# EAGLE design 1 (EAGLE 6.4)
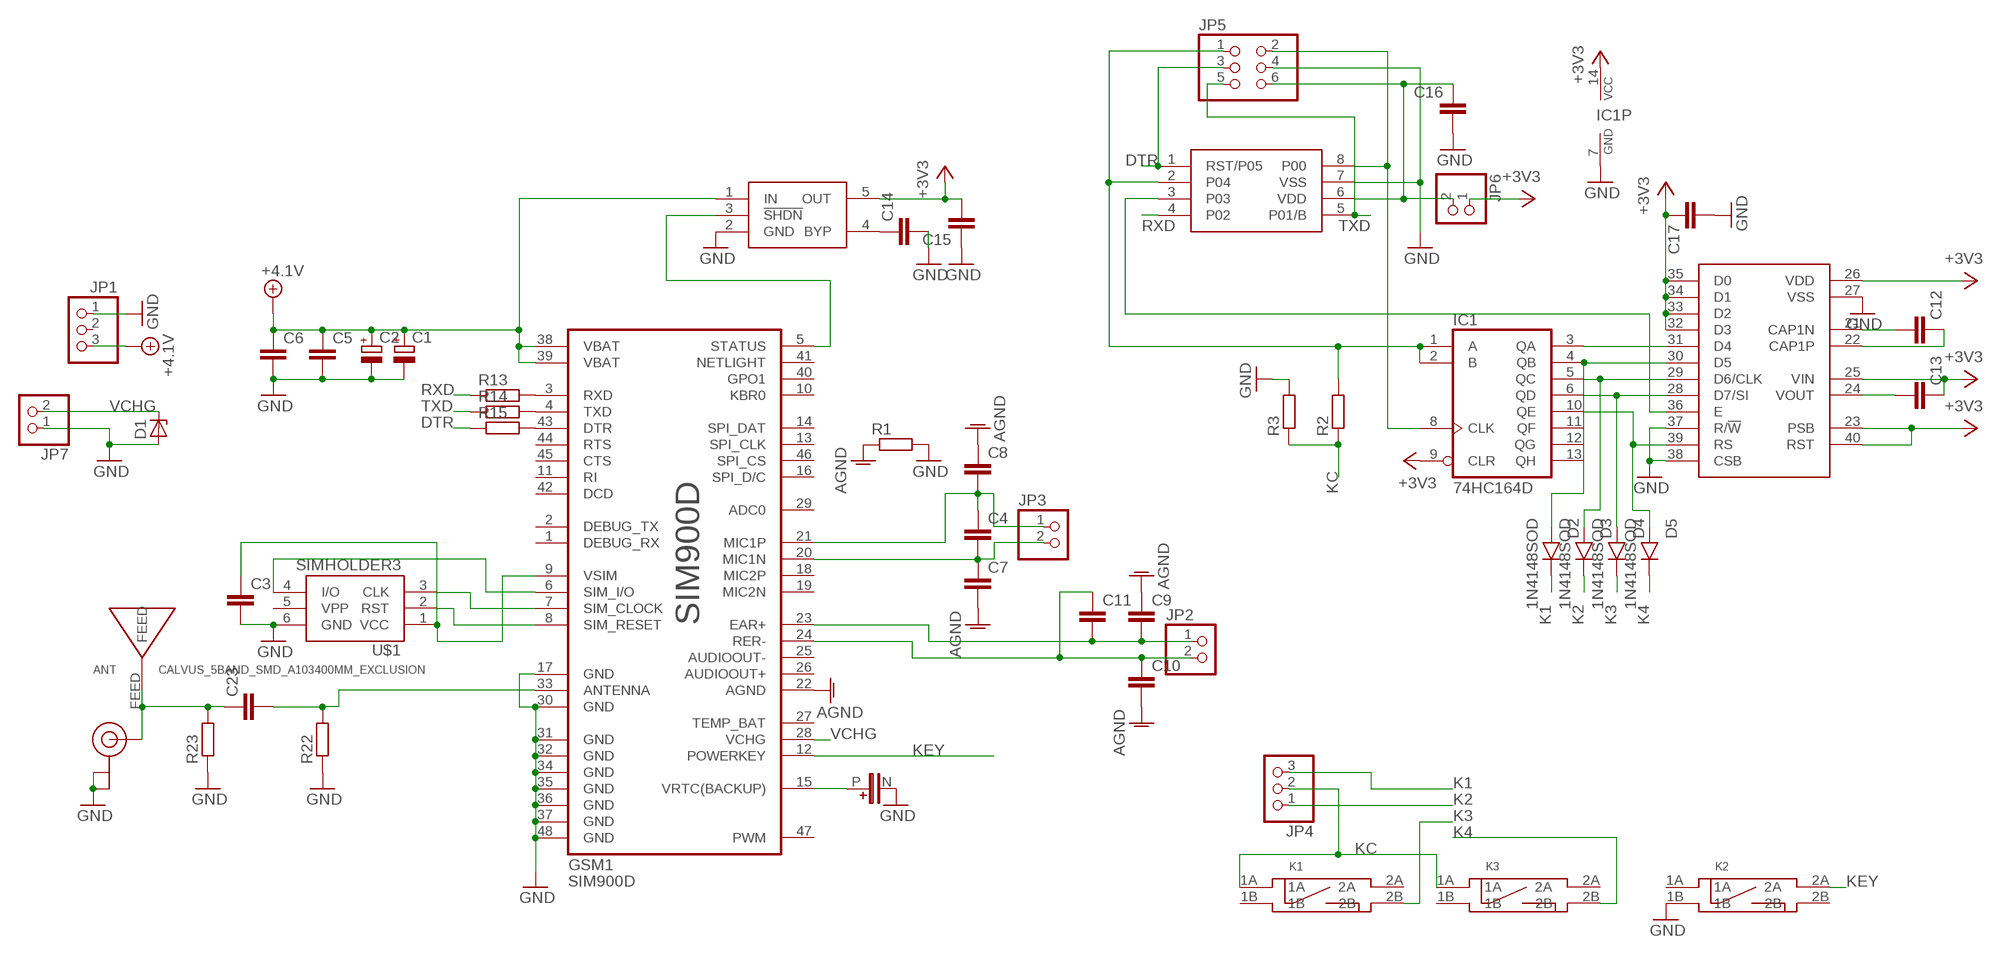
[diagram p0: schematic, sheet 1]

## Parts
ANT  CALVUS_5BAND_SMD_A103400MM_EXCLUSION  [CALVUS_5BAND_SMD_A10340_0MM_EXCLUSION]
C1  CPOL-EUSMCB  [SMC_B]
C2  CPOL-EUSMCB  [SMC_B]
C3  C_0806  [R0805]
C4  C_0806  [R0805]
C5  C_1206  [R1206]
C6  C_1206  [R1206]
C7  C_0806  [R0805]
C8  C_0806  [R0805]
C9  C_0806  [R0805]
C10  C_0806  [R0805]
C11  C_0806  [R0805]
C12  C_0806  [R0805]
C13  C_0806  [R0805]
C14  C_0806  [R0805]
C15  C_0806  [R0805]
C16  C_0806  [R0805]
C17  C_0806  [R0805]
C23  C_0603  [0603]
D1  ZENER-DIODESMB  [SMB]
D2  1N4148SOD  [SOD-80]
D3  1N4148SOD  [SOD-80]
D4  1N4148SOD  [SOD-80]
D5  1N4148SOD  [SOD-80]
GSM1  SIM900D  [SIM900D]
IC1  74HC164D  [SO14]
JP1  PINHD-1X03_2.54-90°  [1X03/90]
JP2  PINHD-1X02_2.00  [1X02M]
JP3  PINHD-1X02_2.00  [1X02M]
JP4  PINHD-1X03_2.54-90°  [1X03/90]
JP5  PINHD-2X3  [2X03]
JP6  PINHD-1X02_2.54-S  [1X02-S]
JP7  PINHD-1X02_2.54-90°  [1X02/90]
K1  SWITCH_BD_B  [SW_SMD2]
K2  SWITCH_BD_B  [SW_SMD2]
K3  SWITCH_BD_B  [SW_SMD2]
LCD2  EAGOG_M  [EADOGM]
R1  R_0805  [R0805]
R2  R_0805  [R0805]
R3  R_0805  [R0805]
R13  R_0805  [R0805]
R14  R_0805  [R0805]
R15  R_0805  [R0805]
R22  R_0603  [0603]
R23  R_0603  [0603]
U$1  SIMHOLDER3  [SIMHOLDER3]
U$2  LPC810DIP  [DIL8]
U$3  TC1015  [SOT23-5]
U$4  SUPERCAP10  [SUPERCAP_10]
U$10  U.FL  [U.FL]

## Nets
+3V3: C13.1 C15.2 C17.1 IC1.9(CLR) IC1.14(VCC) JP6.1 LCD2.23(PSB) LCD2.25(VIN) LCD2.26(VDD) LCD2.32(D3) LCD2.33(D2) LCD2.34(D1) LCD2.35(D0) LCD2.40(RST) U$3.5(OUT)
+4.1V: C1.+ C2.+ C5.1 C6.1 GSM1.38(VBAT) GSM1.39(VBAT) JP1.3 U$3.1(IN)
ABC: IC1.1(A) IC1.2(B) JP5.1 R2.2 U$2.2(P04)
AGND: C7.2 C8.1 C9.1 C10.2 GSM1.22(AGND) R1.1
DTR: JP5.3 R15.1 U$2.1(RST/P05)
GND: C1.- C2.- C3.2 C5.2 C6.2 C14.2 C15.1 C16.2 C17.2 D1.A GSM1.17(GND) GSM1.30(GND) GSM1.31(GND) GSM1.32(GND) GSM1.34(GND) GSM1.35(GND) GSM1.36(GND) GSM1.37(GND) GSM1.48(GND) IC1.7(GND) JP1.1 JP5.4 JP7.1 K2.1B LCD2.27(VSS) LCD2.37(R/!W) LCD2.38(CSB) R1.2 R3.2 R22.1 R23.1 U$1.6(GND) U$2.7(VSS) U$3.2(GND) U$4.N U$10.P$1(GND) U$10.P$2(GND)
K1: D2.K JP4.3
K2: D3.K JP4.1
K3: D4.K K1.2B
K4: D5.K K3.2B
KC: JP4.2 K1.1A K3.1A R2.1 R3.1
KEY: GSM1.12(POWERKEY) K2.2A
N$1: GSM1.8(SIM_RESET) U$1.2(RST)
N$2: GSM1.7(SIM_CLOCK) U$1.3(CLK)
N$3: GSM1.6(SIM_I/O) U$1.4(I/O)
N$4: C3.1 GSM1.9(VSIM) U$1.1(VCC)
N$5: GSM1.5(STATUS) U$3.3(!SHDN)
N$6: C14.1 U$3.4(BYP)
N$10: C16.1 JP5.6 JP6.2 U$2.6(VDD)
N$11: IC1.8(CLK) JP5.2 U$2.8(P00)
N$12: C4.2 C7.1 GSM1.20(MIC1N) JP3.2
N$13: C4.1 C8.2 GSM1.21(MIC1P) JP3.1
N$14: C9.2 C11.2 GSM1.23(EAR+) JP2.1
N$15: C10.1 C11.1 GSM1.24(RER-) JP2.2
N$16: D5.A IC1.10(QE) LCD2.39(RS)
N$17: LCD2.36(E) U$2.3(P03)
N$18: C13.2 LCD2.24(VOUT)
N$19: C12.2 LCD2.21(CAP1N)
N$20 [antenna]: C23.2 GSM1.33(ANTENNA) R22.2
N$21: C12.1 LCD2.22(CAP1P)
N$22: IC1.3(QA) LCD2.31(D4)
N$25: D4.A IC1.6(QD) LCD2.28(D7/SI)
N$26: GSM1.3(RXD) R13.2
N$27: GSM1.4(TXD) R14.2
N$28: GSM1.43(DTR) R15.2
N$31: D2.A IC1.4(QB) LCD2.30(D5)
N$32: D3.A IC1.5(QC) LCD2.29(D6/CLK)
N$33 [antenna]: ANT.FEED C23.1 R23.2 U$10.P$3(SIGNAL)
RXD: R13.1 U$2.4(P02)
TXD: JP5.5 R14.1 U$2.5(P01/B)
VCHG: D1.C GSM1.28(VCHG) JP7.2
VRTC(BACKUP): GSM1.15(VRTC(BACKUP)) U$4.P
Unconnected: GSM1.1(DEBUG_RX) GSM1.2(DEBUG_TX) GSM1.10(KBR0) GSM1.11(RI) GSM1.13(SPI_CLK) GSM1.14(SPI_DAT) GSM1.16(SPI_D/C) GSM1.18(MIC2P) GSM1.19(MIC2N) GSM1.25(AUDIOOUT-) GSM1.26(AUDIOOUT+) GSM1.27(TEMP_BAT) GSM1.29(ADC0) GSM1.40(GPO1) GSM1.42(DCD) GSM1.44(RTS) GSM1.45(CTS) GSM1.46(SPI_CS) GSM1.47(PWM) IC1.11(QF) IC1.12(QG) IC1.13(QH) JP1.2 K1.1B K1.2A K2.1A K2.2B K3.1B K3.2A U$1.5(VPP)

## Power pins joined to a net without a drawn wire
NETLIGHT: GSM1.41(NETLIGHT)

## Library data of the parts
ANT = SmartPrj:CALVUS_5BAND_SMD_A10340
C1 C2 = _rcl:CPOL-EU: POLARIZED CAPACITOR, European symbol
C3-C17 C23 = _moja:C
D1 = diode:ZENER-DIODE: Z-Diode
D2-D5 = _mcom5:1N4148
GSM1 = SIM900D:SIM900D: maciek@chwarzno.pl Maciej Kalinowski SIM900D MARITEX: SIM900D http://wm.sim.com/upfile/201264161119f.pdf
IC1 = 74xx-eu:74*164: 8-bit parallel out SHIFT REGISTER
JP1 JP4 = pinhead-2:PINHD-1X03: PIN HEADER
JP2 JP3 JP6 JP7 = pinhead-2:PINHD-1X02: PIN HEADER
JP5 = pinhead:PINHD-2X3: PIN HEADER
K1-K3 = _moja:SWITCH_BD
LCD2 = _mcom5:EAGOG_M
R1-R3 R13-R15 R22 R23 = _moja:R
U$1 = SparkFun:SIMHOLDER3
U$2 = _mcom5:LPC810
U$3 = _moja:TC1015
U$4 = _moja:SUPERCAP
U$10 = SparkFun:U.FL

## Net classes
4 antenna: clearance 0.61 mm

## Board
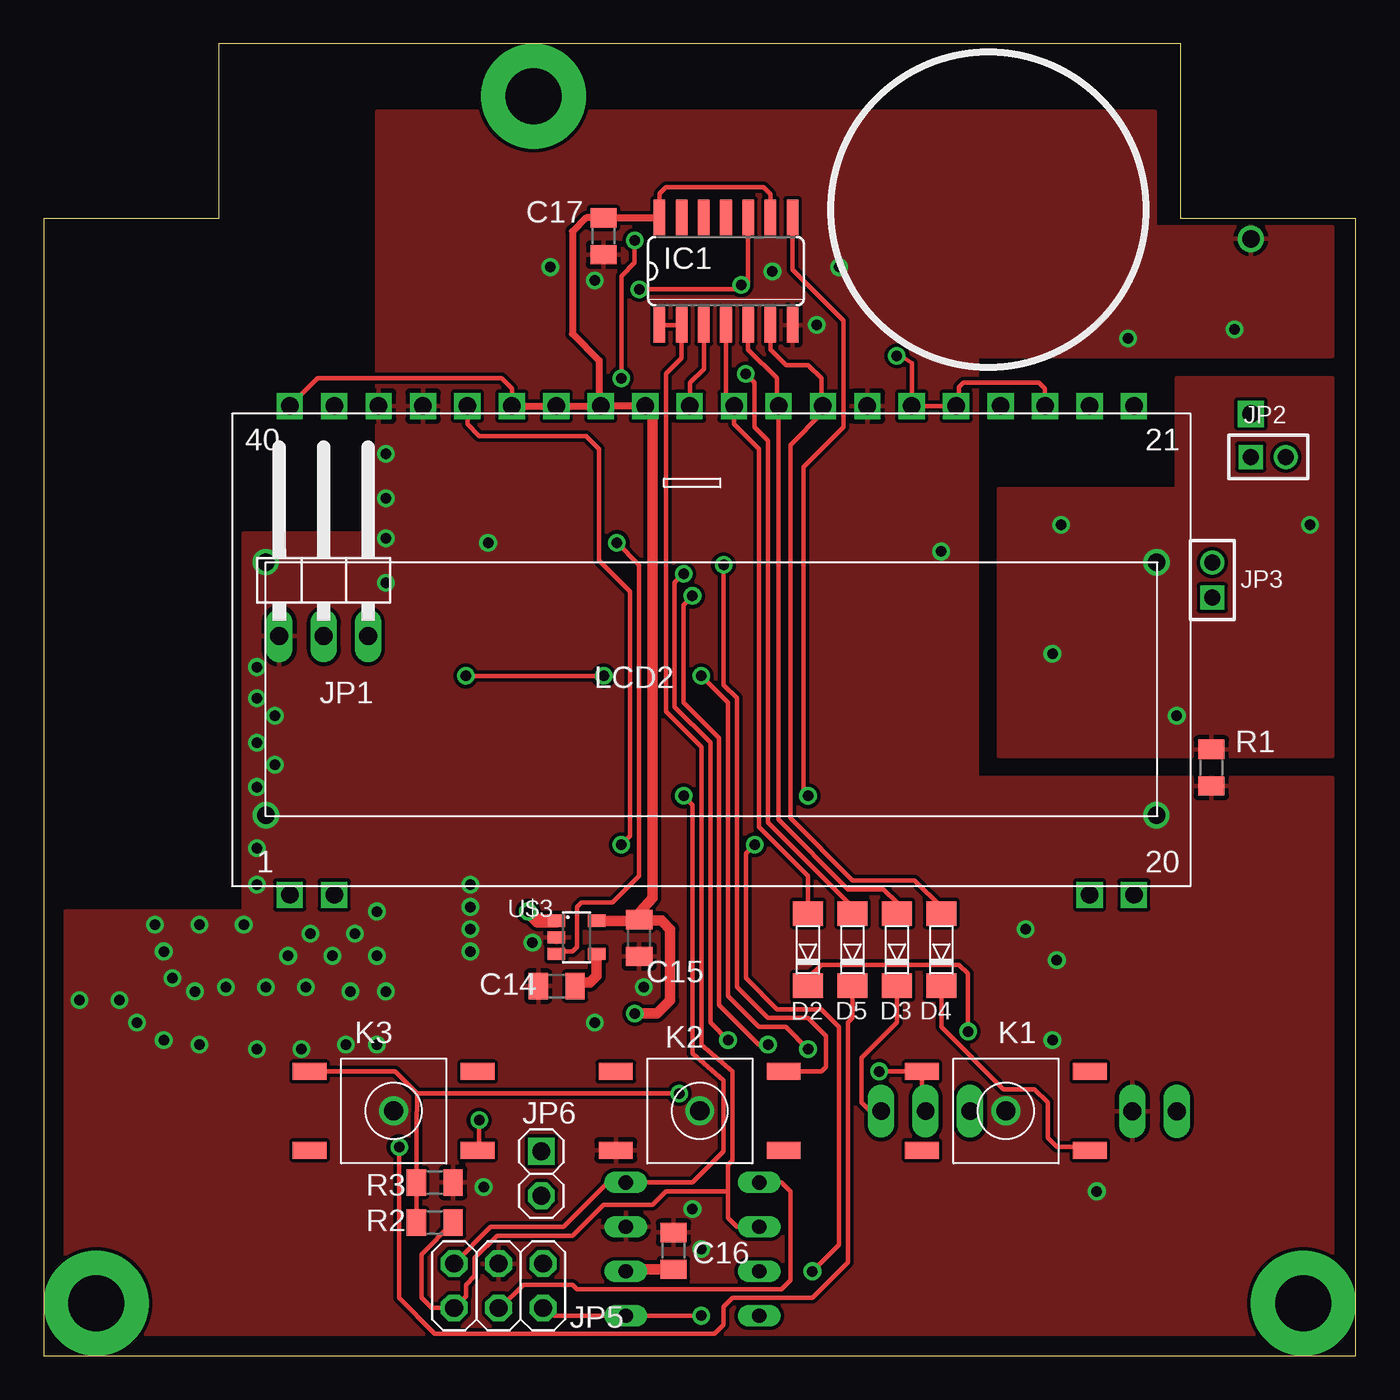
[diagram p1: board, top side]
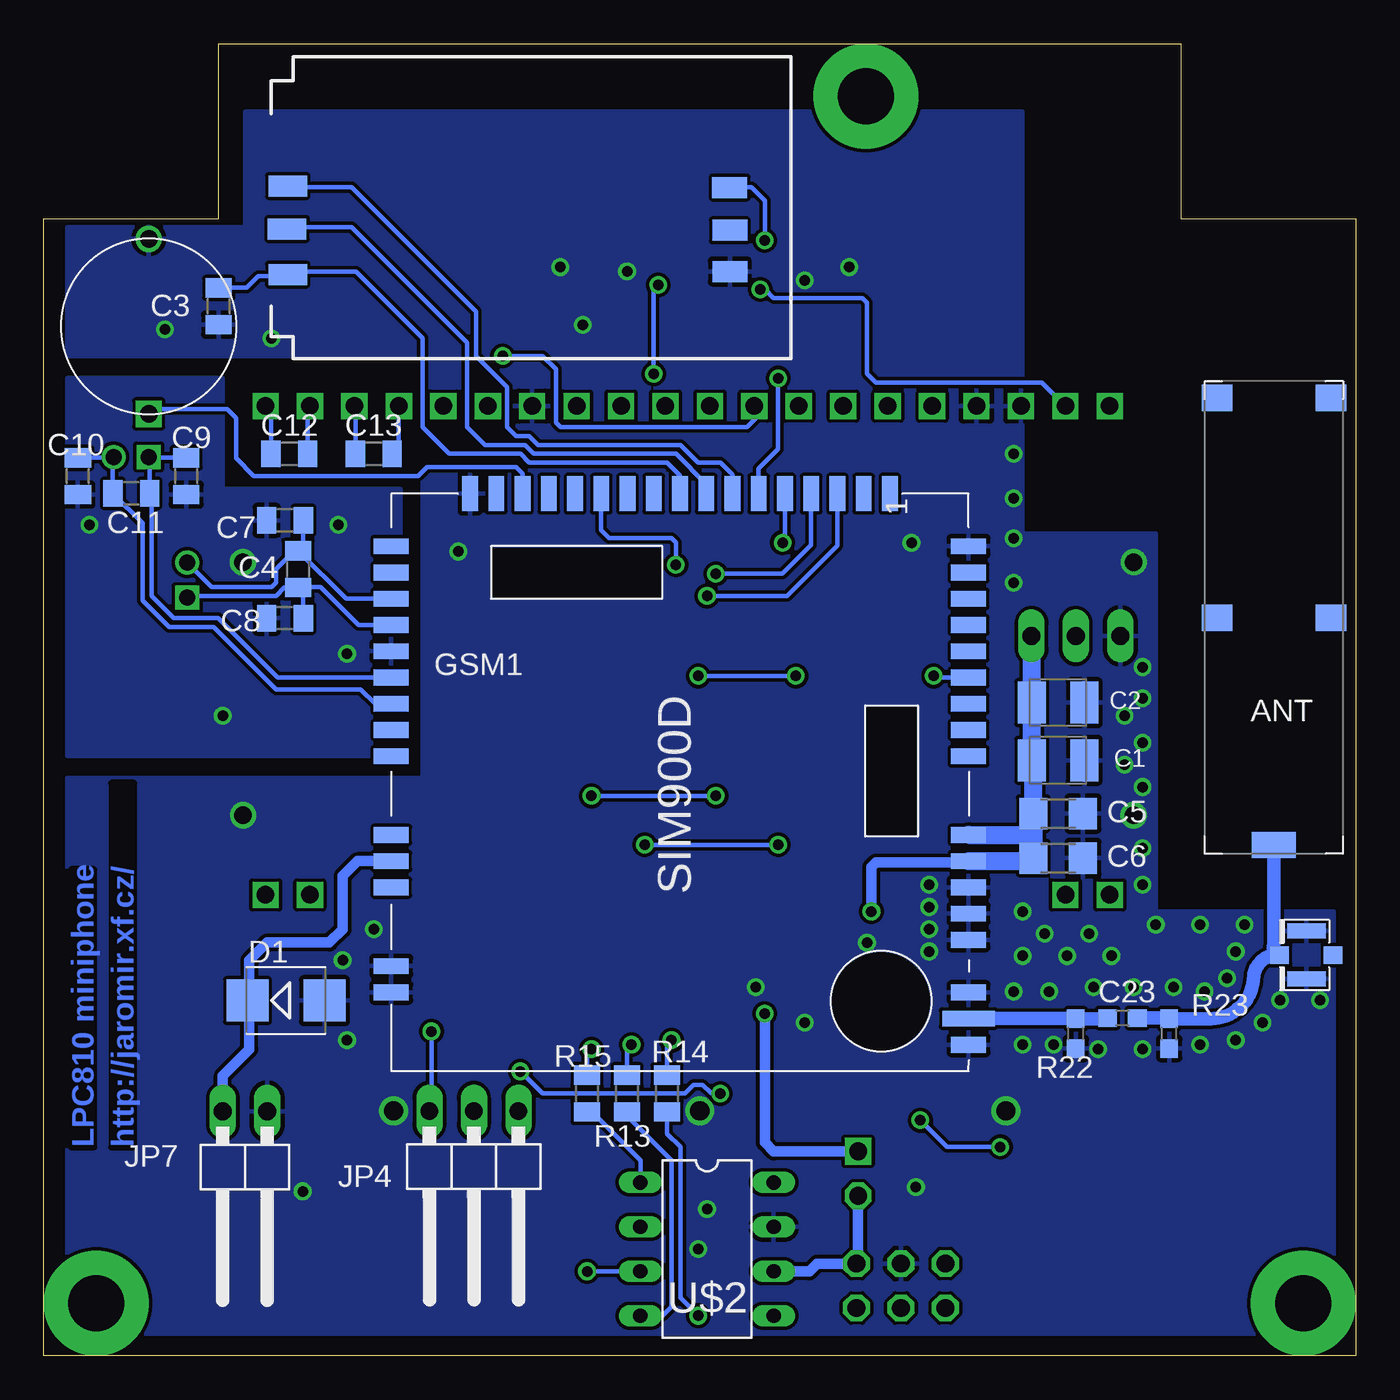
[diagram p2: board, bottom side, seen from below]

Size 75 x 75 mm. Coordinates in mm from the lower left corner, seen from the top.
Outline: 0,0 75,0 75,65 65,65 65,75 10,75 10,65 0,65 0,0
Copper layers (1*16): Top 0.035mm / dielectric 1.5mm / Bottom 0.035mm
Design rules "check8": minimum track width 8mil, minimum drill 23mil, track to track 8mil, track to pad 8mil, pad to pad 8mil, via to via 8mil, smd to smd 8mil, copper to edge 10mil, drill to drill 8mil, minimum pad ring 8mil, minimum via ring 8mil, stop-mask expansion 4mil, vias tented up to drill 0mil, thermal gap 10mil

### Footprints (pad centres in the part's own frame; a part is rotated, then mirrored left to right if it is on the bottom)
CALVUS_5BAND_SMD_A10340_0MM_EXCLUSION = smd 2.5 x 1.5: FEED 3.95,0.5 | smd 1.75 x 1.5: FIXINGPOINT$1 0.7,26.05; FIXINGPOINT$2 7.22,26.05; FIXINGPOINT$3 0.7,13.49; FIXINGPOINT$4 7.22,13.49
SMC_B = smd 1.6 x 2.4: + -1.5,0; - 1.5,0
R0805 = smd 1.1 x 1.5: 1 -1.05,0; 2 1.05,0
R1206 = smd 1.6 x 1.803: 1 -1.422,0; 2 1.422,0
0603 = smd 1.067 x 1: 1 -0.85,0; 2 0.85,0
SMB = smd 2.4 x 2.4: A 2.2,0; C -2.2,0
SOD-80 = smd 1.397 x 1.702: A 1.905,0; K -2.223,0
SIM900D = smd 2 x 0.9: 1 0,28.5; 2 0,27; 3 0,25.5; 4 0,24; 5 0,22.5; 6 0,21; 7 0,19.5; 8 0,18; 9 0,16.5; 10 0,15; 11 0,13.5; 12 0,12; 13 0,10.5; 14 0,9; 15 0,7.5; 16 0,6; 17 0,4.5 | smd 0.9 x 2: 18 3,0; 19 4.5,0; 20 6,0; 21 7.5,0; 22 9,0; 23 10.5,0; 24 12,0; 25 13.5,0; 26 15,0; 27 19.5,0; 28 21,0; 29 22.5,0; 30 27,0; 31 28.5,0; 32 31.5,33; 34 28.5,33; 35 25.5,33; 36 24,33; 37 22.5,33; 38 21,33; 39 19.5,33; 40 15,33; 41 13.5,33; 42 12,33; 43 10.5,33; 44 9,33; 45 7.5,33; 46 6,33; 47 4.5,33; 48 3,33 | smd 0.9 x 3: 33 30,33
SO14 = smd 0.66 x 2.032: 1 -3.81,-3.073; 2 -2.54,-3.073; 3 -1.27,-3.073; 4 0,-3.073; 5 1.27,-3.073; 6 2.54,-3.073; 7 3.81,-3.073; 8 3.81,3.073; 9 2.54,3.073; 10 1.27,3.073; 11 0,3.073; 12 -1.27,3.073; 13 -2.54,3.073; 14 -3.81,3.073
1X03/90 = drill 1.016 long: 1 -2.54,-3.81; 2 0,-3.81; 3 2.54,-3.81
1X02M = drill 0.914 square: 1 -1,0 | drill 0.914: 2 1,0
2X03 = drill 1.016 octagon: 1 -2.54,-1.27; 2 -2.54,1.27; 3 0,-1.27; 4 0,1.27; 5 2.54,-1.27; 6 2.54,1.27
1X02-S = drill 1.016 square: 1 -1.27,0 | drill 1.016 octagon: 2 1.27,0
1X02/90 = drill 1.016 long: 1 -2.54,-3.81; 2 0,-3.81
SW_SMD2 = smd 1.93 x 0.965: 1A -4.8,2.25; 1B -4.8,-2.25; 2A 4.8,2.25; 2B 4.8,-2.25
EADOGM = drill 1 square: 1 -23.44,-13.65; 2 -20.9,-13.65; 19 22.28,-13.65; 20 24.82,-13.65; 21 24.82,14.29; 22 22.28,14.29; 23 19.74,14.29; 24 17.2,14.29; 25 14.66,14.29; 26 12.12,14.29; 27 9.58,14.29; 28 7.04,14.29; 29 4.5,14.29; 30 1.96,14.29; 31 -0.58,14.29; 32 -3.12,14.29; 33 -5.66,14.29; 34 -8.2,14.29; 35 -10.74,14.29; 36 -13.28,14.29; 37 -15.82,14.29; 38 -18.36,14.29; 39 -20.9,14.29; 40 -23.44,14.29
SIMHOLDER3 = smd 2.2 x 1.2: 1 0.95,4.81; 2 0.91,7.41; 3 0.95,9.86 | smd 2 x 1.2: 4 26.2,9.78; 5 26.22,7.34; 6 26.22,4.98
DIL8 = drill 0.813 long: 1 -3.81,-3.81; 2 -1.27,-3.81; 3 1.27,-3.81; 4 3.81,-3.81; 5 3.81,3.81; 6 1.27,3.81; 7 -1.27,3.81; 8 -3.81,3.81
SOT23-5 = smd 0.7 x 1: 1 -0.99,-1.17; 2 -0.04,-1.17; 3 0.91,-1.17; 4 0.91,1.13; 5 -0.99,1.13
SUPERCAP_10 = drill 1: N 5,0 | drill 1 square: P -5,0
U.FL = smd 2.2 x 0.85: P$1 0,1.375; P$2 0,-1.375 | smd 1.05 x 1: P$3 1.525,0; P$4 -1.525,0

### Placement (x,y rotation side)
ANT  8.64,28.7 0 bottom
C1  17.02,34.04 0 bottom
C2  17.02,37.34 0 bottom
C3  65,60 270 bottom
C4  60.45,44.96 90 bottom
C5  17.02,30.99 0 bottom
C6  17.02,28.45 0 bottom
C7  61.21,47.75 180 bottom
C8  61.21,42.16 0 bottom
C9  66.86,50.28 90 bottom
C10  73.05,50.28 270 bottom
C11  70,49.3 0 bottom
C12  60.96,51.56 180 bottom
C13  56.13,51.56 0 bottom
C14  29.33,21.13 180 top
C15  34.04,23.88 90 top
C16  36,6 90 top
C17  32,64 270 top
C23  13.34,19.3 180 bottom
D1  61.15,20.31 0 bottom
D2  43.69,23.37 90 top
D3  48.77,23.37 90 top
D4  51.31,23.37 90 top
D5  46.23,23.37 90 top
GSM1  55.13,49.27 270 bottom
IC1  39,62 0 top
JP1  16,44.96 0 top
JP2  70,51.38 0 top
JP3  66.8,44.34 90 top
JP4  50.41,10.18 180 bottom
JP5  26,4 0 top
JP6  28.45,10.41 270 top
JP7  64.77,10.16 180 bottom
K1  55,14 0 top
K2  37.5,14 0 top
K3  20,14 0 top
LCD2  37.5,40 0 top
R1  66.75,33.62 270 top
R2  22.35,7.62 0 top
R3  22.35,9.91 0 top
R13  41.66,14.99 90 bottom
R14  39.37,14.99 90 bottom
R15  43.94,14.99 90 bottom
R22  16,18.41 90 bottom
R23  10.67,18.41 90 bottom
U$1  62,57 0 bottom
U$2  37.08,6.1 270 bottom
U$3  30.48,23.88 270 top
U$4  69,58.85 90 bottom
U$10  2.83,22.91 180 bottom

### Tracks (layer width: path | path; a pad name or v marks a point on that pad's centre or on a via)
+3V3  (via drill 0.6)
  Top 0.254: LCD2.35 26.76,55.28 26.16,55.88 15.65,55.88 LCD2.40 | 35.17,65.05 IC1.14 35.19,66.43 35.56,66.8 41.15,66.8 41.54,66.41 IC1.9 | v48.77,57.15 49.02,57.15 49.62,56.73 LCD2.26 LCD2.25 52.32,54.45 52.32,55.37 52.58,55.63 56.9,55.63 57.24,55.28 LCD2.23
  Top 0.406: LCD2.33 31.75,54.71 31.75,56.9 30.23,58.42 30.23,64.26 31.01,65.05 C17.1 35.17,65.05 | LCD2.32 LCD2.33 | LCD2.33 LCD2.34 LCD2.35
  Top 0.61: C15.2 34.07,25.36 34.8,26.16 34.8,53.95 LCD2.32 | 34.04,24.89 C15.2 | v33.78,19.56 35.05,19.56 35.81,20.32 35.81,24.38 35.31,24.89 34.2,24.89 C15.2 | U$3.5 33.98,24.87 C15.2
  Bottom 0.254: v48.77,57.15 46.48,57.15 45.72,56.39 45.72,53.34 45.47,53.09 34.8,53.09 34.29,53.59 34.29,54.2 LCD2.32 | C13.1 57.18,54.23 LCD2.23
  Bottom 0.61: JP6.1 33.27,11.68 33.78,12.19 v33.78,19.56
+4.1V  (via drill 0.6)
  Top 0.762: U$3.1 28.22,24.87 v27.69,25.4
  Bottom 0.61: v27.69,25.4 27.69,27.94 27.43,28.19 22.21,28.19 GSM1.38
  Bottom 1.016: GSM1.39 18.64,29.77 C5.1 | GSM1.38 19.28,28.27 18.87,28.37 | 18.87,28.37 C6.1 | C5.1 18.44,28.3 18.87,28.37 | C5.1 18.44,33.2 C1.+ C2.+ 18.52,41.12 JP1.3
ABC
  Top 0.254: 39.12,9.4 39.12,10.92 39.37,11.18 39.37,16.26 37.59,17.78 37.59,34.8 35.56,36.83 35.56,56.13 36.46,57.03 IC1.2 IC1.1 | 39.12,9.4 39.12,7.87 39.62,7.37 U$2.2 | R2.2 21.59,5.81 21.59,3.3 22.16,2.73 JP5.1 24.13,3.4 24.13,4.06 24.64,4.57 24.64,5.59 25.91,6.86 30.23,6.86 32,8.64 34.8,8.64 35.56,9.4 39.12,9.4
AGND  (via drill 0.6, 1)
  other vias: 57.66,40.13 58.17,47.5 63.61,45.35 72.39,47.5 64.77,36.58
  pour Top: 73.66,34.29 54.61,34.29 54.61,49.53 64.77,49.53 64.77,55.88 73.66,55.88
  pour Bottom: 73.66,34.29 54.61,34.29 54.61,49.53 64.77,49.53 64.77,55.88 73.66,55.88
DTR
  Top 0.254: JP5.3 26.1,2.73 27.43,4.06 30.23,4.06 30.48,3.81 42.16,3.81 42.67,4.32 42.67,9.4 42.16,9.91 U$2.1
  Bottom 0.254: R15.1 43.65,13.94 40.89,11.18 U$2.1
GND  (via drill 0.6, 1, 1.1)
  other vias: 13.97,22.86 27.94,23.62 31.5,61.47 34.29,21.08 44.2,58.93 41.66,61.98 45.47,62.23 28.96,62.23 57.91,22.61 56.13,24.38 57.66,18.03 37.59,6.1 37.08,8.38 31.5,19.05 19.05,25.4 24.38,24.38 24.38,23.11 19.56,20.83 17.53,20.83 14.99,21.08 12.7,21.08 10.41,21.08 8.64,20.83 7.37,21.59 6.86,23.11 6.35,24.64 4.32,20.32 5.33,19.05 6.86,18.03 8.89,17.78 12.19,17.53 14.73,17.53 17.27,17.78 19.05,17.78 8.89,24.64 11.43,24.64 12.19,26.92 12.19,29.02 12.19,32.51 12.19,35.05 12.19,37.59 12.19,39.37 19.56,44.2 19.56,46.74 19.56,49.02 19.56,51.56 61.98,58.17 68.07,58.67 25.4,46.48 51.31,45.97 25.15,9.65 60.2,9.4 2.03,20.32 24.38,25.65 17.78,24.13 12.7,30.9 13.21,33.78 13.21,36.58 37.5,14 20,14 55,14 63.6,30.9 12.69,45.37 19.05,22.86 16.51,22.86 15.24,24.13 24.38,26.92
  pour Bottom: 1.27,1.27 73.66,1.27 73.66,33.02 53.34,33.02 53.34,57.15 73.66,57.15 73.66,64.52 63.5,64.52 63.5,71.12 19.05,71.12 19.05,46.99 11.43,46.99 11.43,25.4 1.27,25.4
  pour Top: 1.27,1.27 73.66,1.27 73.66,33.02 53.34,33.02 53.34,57.15 73.66,57.15 73.66,64.52 63.5,64.52 63.5,71.12 19.05,71.12 19.05,46.99 11.43,46.99 11.43,25.4 1.27,25.4
K1  (via drill 0.6)
  Top 0.254: D2.K 43.69,21.59 44.45,22.35 52.32,22.35 52.83,21.84 v52.83,18.54
  Bottom 0.254: v52.83,18.54 52.83,14.22 52.95,14.11 JP4.3
K2
  Top 0.254: D3.K 48.77,19.05 46.74,17.02 46.74,14.48 47.24,13.97 47.84,13.97 JP4.1
K3
  Top 0.254: D4.K 51.31,18.8 54.86,15.24 56.64,15.24 57.4,14.48 57.4,12.45 57.91,11.94 59.61,11.94 K1.2B
K4  (via drill 0.6)
  Top 0.254: D5.K 46.23,19.3 45.97,19.05 45.97,5.33 43.94,3.3 39.37,3.3 38.86,2.79 38.86,1.78 38.35,1.27 22.35,1.27 20.32,3.3 v20.32,11.94 | v24.89,13.46 24.89,11.84 K3.2B
  Bottom 0.254: v20.32,11.94 23.37,11.94 v24.89,13.46
KC  (via drill 0.6)
  Top 0.254: v47.75,16.26 K1.1A | K1.1A | R2.1 R3.1 21.3,12.92 21.34,14.99 | K1.1A 50.2,14.15 JP4.2 | K3.1A 20.07,16.25 21.34,14.99 | 21.34,14.99 v36.32,14.99
  Bottom 0.254: v36.32,14.99 36.83,14.99 37.34,15.49 37.85,15.49 38.35,14.99 46.48,14.99 v47.75,16.26
KEY  (via drill 0.6)
  Top 0.254: v38.86,45.21 38.86,38.35 39.62,37.59 39.62,21.08 41.4,19.3 43.69,19.3 44.7,18.29 44.7,16.51 44.45,16.26 K2.2A
  Bottom 0.254: GSM1.12 43.13,47.2 42.67,46.74 39.12,46.74 38.86,46.48 v38.86,45.21
N$1
  Bottom 0.254: GSM1.8 37.13,49.83 38.86,51.56 46.99,51.56 47.5,52.07 49.78,52.07 50.8,53.09 50.8,57.91 57.4,64.52 60.98,64.52 U$1.2
N$2
  Bottom 0.254: GSM1.7 35.63,50.37 36.32,51.05 37.59,51.05 38.61,52.07 46.74,52.07 47.24,52.58 48.01,52.58 48.51,53.09 48.51,55.37 50.29,57.15 50.29,59.69 57.4,66.8 60.99,66.8 U$1.3
N$3  (via drill 0.6)
  Top 0.254: v33.02,55.88 33.02,61.72 33.78,62.48 v33.78,63.75
  Bottom 0.254: GSM1.6 34.13,50.7 33.02,51.82 v33.02,55.88 | U$1.4 35.78,66.8 34.54,66.8 33.78,66.04 v33.78,63.75
N$4
  Bottom 0.254: GSM1.9 38.63,50.32 39.37,51.05 47.24,51.05 47.75,51.56 51.82,51.56 53.34,53.09 53.34,58.17 57.15,61.98 60.88,61.98 U$1.1 61.14,61.72 62.74,61.72 63.41,61.05 C3.1
N$5  (via drill 0.6)
  Top 0.254: v32.77,46.48 34.04,45.21 34.04,27.43 32.51,25.91 30.73,25.91 30.48,25.65 30.48,23.37 30.23,23.11 29.48,23.11 U$3.3 29.46,23.03
  Bottom 0.254: GSM1.5 32.63,46.61 v32.77,46.48
N$6
  Top 0.61: U$3.4 31.61,21.7 31.24,21.34 30.58,21.34 C14.1
N$7  (via drill 3.2 pad 6)
  other vias: 28,72
N$8  (via drill 3.2 pad 6)
  other vias: 3,3
N$9  (via drill 3.2 pad 6)
  other vias: 72,3
N$10
  Top 0.61: C16.1 33.4,4.95 U$2.6
  Bottom 0.61: JP6.2 28.45,5.36 JP5.6 30.8,5.27 31.24,4.83 U$2.6
N$11  (via drill 0.6)
  Top 0.254: IC1.8 42.81,62.09 45.72,59.18 45.72,53.09 43.43,50.8 43.43,32.26 v43.69,32 | v36.58,32 37.08,31.5 37.08,17.27 38.86,15.75 38.86,11.68 37.08,9.91 U$2.8 32.26,9.91 29.72,7.37 25.56,7.37 JP5.2
  Bottom 0.254: v43.69,32 v36.58,32
N$12
  Bottom 0.254: GSM1.20 57.72,43.27 C4.2 | C7.1 60.16,46.3 C4.2 | C4.2 60.45,45.85 60.83,45.85 61.72,44.96 61.72,44.2 61.98,43.94 65.4,43.94 JP3.2
N$13
  Bottom 0.254: GSM1.21 57.01,41.77 59.18,43.94 60.42,43.94 C4.1 | C8.2 60.16,43.62 C4.1 | C4.1 61.25,43.91 61.72,43.43 66.71,43.43 JP3.1
N$14
  Bottom 0.254: GSM1.23 61.63,38.77 65.02,42.16 67.56,42.16 68.83,43.43 68.83,49.18 C11.2 68.95,51.33 JP2.1 68.95,51.33 C9.2
N$15
  Bottom 0.254: GSM1.24 56.07,37.27 56.9,38.1 61.72,38.1 65.28,41.66 67.82,41.66 69.34,43.18 69.34,47.59 C11.1 71.05,51.33 JP2.2 71.05,51.33 C10.1
N$16  (via drill 0.6)
  Top 0.254: IC1.10 40.27,61.35 40.01,61.09 | 40.01,61.09 39.88,60.96 v34.04,60.96 | D5.A 46.23,25.65 41.4,30.48 41.4,52.32 40.64,53.09 40.64,55.63 v40.13,56.13 | v39.88,61.21 40.01,61.09
  Bottom 0.254: v34.04,60.96 33.78,60.96 33.27,60.45 28.19,60.45 27.94,60.2 27.94,56.13 27.43,55.63 17.94,55.63 LCD2.39 | v40.13,56.13 40.13,60.96 v39.88,61.21
N$17  (via drill 0.6)
  Top 0.254: LCD2.36 24.22,53.25 24.89,52.58 30.99,52.58 31.75,51.82 31.75,45.47 33.53,43.69 33.53,29.72 v33.02,29.21 | v40.64,29.21 40.13,28.7 40.13,21.59 41.91,19.81 44.45,19.81 45.47,18.8 45.47,6.35 v43.94,4.83
  Bottom 0.254: v33.02,29.21 v40.64,29.21 | v43.94,4.83 U$2.3
N$18
  Bottom 0.254: LCD2.24 54.7,51.95 C13.2
N$19
  Bottom 0.254: C12.2 62.01,53.98 LCD2.21
N$20
  Bottom 0.762: GSM1.33 R22.2 14.19,19.27 C23.2
N$21
  Bottom 0.254: C12.1 59.91,54.16 LCD2.22
N$22
  Top 0.254: IC1.3 37.73,56.4 36.96,55.63 36.96,54.33 LCD2.31
N$25
  Top 0.254: D4.A 51.31,25.65 49.78,27.18 46.23,27.18 42.67,30.73 42.67,52.07 44.54,53.94 LCD2.28 44.45,54.38 44.45,55.88 43.69,56.64 42.42,56.64 41.54,57.52 IC1.6
N$26  (via drill 0.6)
  Top 0.254: v37.08,43.43 36.58,42.93 36.58,37.34 38.61,35.31 38.61,20.07 40.89,17.78 v41.4,17.78
  Bottom 0.254: GSM1.3 29.63,46.31 32.51,43.43 v37.08,43.43 | v41.4,17.78 41.66,17.53 R13.2
N$27  (via drill 0.6)
  Top 0.254: v36.58,44.7 36.07,44.2 36.07,37.08 38.1,35.05 38.1,19.05 v39.12,18.03
  Bottom 0.254: GSM1.4 31.13,46.34 32.77,44.7 v36.58,44.7 | v39.12,18.03 39.37,17.78 R14.2
N$28  (via drill 0.6)
  Top 0.254: v24.13,38.86 v32,38.86 | v37.59,38.86 39.12,37.34 39.12,20.57 40.89,18.8 42.42,18.8 v43.69,17.53
  Bottom 0.254: GSM1.43 24.04,38.77 v24.13,38.86 | v32,38.86 v37.59,38.86 | v43.69,17.53 43.94,17.27 R15.2
N$31
  Top 0.254: IC1.4 39,54.75 LCD2.30 39.46,53.25 40.89,51.82 40.89,30.23 43.69,27.43 D2.A
N$32
  Top 0.254: D3.A 48.77,25.65 48.77,25.91 48.01,26.67 45.97,26.67 42,30.64 42,32.42 LCD2.29 41.91,54.38 41.91,55.88 40.27,57.52 IC1.5
N$33
  Bottom 0.762: C23.1 10.67,19.3 R23.2 8.29,19.27 arc-90 5.84,21.72 5.84,21.67 arc90 U$10.P$3 arc90 4.69,23.5 ANT.FEED
RXD
  Bottom 0.254: R13.1 41.4,13.46 39.12,11.18 39.12,2.79 39.62,2.29 U$2.4
TXD  (via drill 0.6)
  Top 0.254: v37.59,2.29 U$2.5 29.21,2.29 28.7,2.79 28.6,2.79 JP5.5
  Bottom 0.254: R14.1 39.37,12.7 38.61,11.94 38.61,3.3 v37.59,2.29
VCHG
  Bottom 0.61: GSM1.28 57.07,28.27 57.91,27.43 57.91,24.38 58.67,23.62 62.23,23.62 63.25,22.61 63.25,20.41 D1.C 63.25,20.21 63.25,17.53 64.77,16 JP7.2
VRTC(BACKUP)
  Bottom 0.254: GSM1.15 47.63,50.43 48.01,50.8 53.09,50.8 53.59,50.29 62.99,50.29 64.01,51.31 64.01,53.59 64.52,54.1 68.9,54.1 U$4.P

### Text on the board
Bottom: http://jaromir.xf.cz/ | LPC810 miniphone